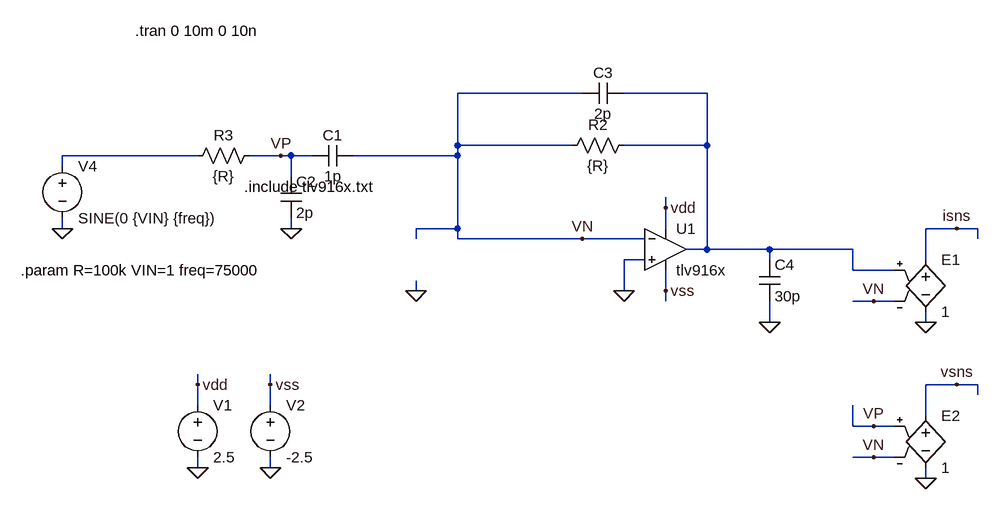
[diagram p0: schematic TIA_transe.asc]
TIA_transe.asc, the LTspice schematic file:
Version 4.1
SHEET 1 988 680
WIRE 368 -48 176 -48
WIRE 560 -48 432 -48
WIRE 176 32 176 -48
WIRE 352 32 176 32
WIRE 560 32 560 -48
WIRE 560 32 432 32
WIRE -224 48 -432 48
WIRE -96 48 -144 48
WIRE -80 48 -96 48
WIRE -48 48 -80 48
WIRE 176 48 176 32
WIRE 176 48 16 48
WIRE -432 64 -432 48
WIRE -80 80 -80 48
WIRE 496 128 496 112
WIRE -432 160 -432 144
WIRE -80 160 -80 144
WIRE 176 160 176 48
WIRE 176 160 112 160
WIRE 496 160 496 128
WIRE 944 160 896 160
WIRE 976 160 944 160
WIRE 112 176 112 160
WIRE 176 176 176 160
WIRE 368 176 176 176
WIRE 464 176 368 176
WIRE 976 176 976 160
WIRE 560 192 560 32
WIRE 560 192 528 192
WIRE 656 192 560 192
WIRE 784 192 656 192
WIRE 464 208 432 208
WIRE 656 208 656 192
WIRE 896 208 896 160
WIRE 784 224 784 192
WIRE 848 224 784 224
WIRE 112 256 112 240
WIRE 432 256 432 208
WIRE 496 256 496 224
WIRE 496 272 496 256
WIRE 816 272 784 272
WIRE 848 272 816 272
WIRE 656 304 656 272
WIRE 896 304 896 288
WIRE -224 400 -224 384
WIRE -112 400 -112 384
WIRE 944 400 896 400
WIRE 976 400 944 400
WIRE 976 416 976 400
WIRE -224 432 -224 400
WIRE -112 432 -112 400
WIRE 896 448 896 400
WIRE 784 464 784 432
WIRE 816 464 784 464
WIRE 848 464 816 464
WIRE 816 512 784 512
WIRE 848 512 816 512
WIRE -224 528 -224 512
WIRE -112 528 -112 512
WIRE 896 544 896 528
FLAG 496 256 vss
FLAG 496 128 vdd
FLAG -224 528 0
FLAG -224 400 vdd
FLAG -112 528 0
FLAG -112 400 vss
FLAG 432 256 0
FLAG 656 304 0
FLAG 112 256 0
FLAG -432 160 0
FLAG 368 176 VN
FLAG 816 272 VN
FLAG 896 304 0
FLAG 944 160 isns
FLAG -96 48 VP
FLAG 816 512 VN
FLAG 896 544 0
FLAG 944 400 vsns
FLAG 816 464 VP
FLAG -80 160 0
SYMBOL voltage -224 416 R0
WINDOW 123 0 0 Left 0
WINDOW 39 0 0 Left 0
SYMATTR InstName V1
SYMATTR Value 2.5
SYMBOL voltage -112 416 R0
WINDOW 123 0 0 Left 0
WINDOW 39 0 0 Left 0
SYMATTR InstName V2
SYMATTR Value -2.5
SYMBOL res 448 16 R90
WINDOW 0 0 56 VBottom 2
WINDOW 3 32 56 VTop 2
SYMATTR InstName R2
SYMATTR Value {R}
SYMBOL cap 432 -64 R90
WINDOW 0 0 32 VBottom 2
WINDOW 3 32 32 VTop 2
SYMATTR InstName C3
SYMATTR Value 2p
SYMBOL cap 640 208 R0
SYMATTR InstName C4
SYMATTR Value 30p
SYMBOL res -128 32 R90
WINDOW 0 0 56 VBottom 2
WINDOW 3 32 56 VTop 2
SYMATTR InstName R3
SYMATTR Value {R}
SYMBOL voltage -432 48 R0
WINDOW 123 0 0 Left 0
WINDOW 39 0 0 Left 0
SYMATTR InstName V4
SYMATTR Value SINE(0 {VIN} {freq})
SYMBOL e 896 192 R0
SYMATTR InstName E1
SYMATTR Value 1
SYMBOL e 896 432 R0
SYMATTR InstName E2
SYMATTR Value 1
SYMBOL OpAmps\\opamp2 496 128 R0
SYMATTR InstName U1
SYMATTR Value tlv916x
SYMBOL cap 16 32 R90
WINDOW 0 0 32 VBottom 2
WINDOW 3 32 32 VTop 2
SYMATTR InstName C1
SYMATTR Value 1p
SYMBOL cap -96 80 R0
SYMATTR InstName C2
SYMATTR Value 2p
TEXT -152 96 Left 2 !.include tlv916x.txt
TEXT -496 224 Left 2 !.param R=100k VIN=1 freq=75000
TEXT -320 -144 Left 2 !.tran 0 10m 0 10n

The netlist it stands for:
* TIA_transe.asc
V1 vdd 0 2.5
V2 vss 0 -2.5
R2 N001 VN {R}
C3 N001 VN 2p
C4 N001 0 30p
R3 VP N002 {R}
V4 N002 0 SINE(0 {VIN} {freq})
E1 isns 0 N001 VN 1
E2 vsns 0 VP VN 1
X§U1 0 VN vdd vss N001 tlv916x  ; pins In+ In- V+ V- OUT
C1 VN VP 1p
C2 VP 0 2p
.include tlv916x.txt
.param R=100k VIN=1 freq=75000
.tran 0 10m 0 10n
.backanno
.end

* Results of the author's LTspice run, read from the files saved beside the schematic
* Operating Point, zero values left out:
*   V(vdd) = 2.5 V
*   V(vss) = -2.5 V
*   I(V1) = -2.4 mA
*   I(V2) = 2.4 mA
*   Ix(u1:in+) = 10 pA
*   Ix(u1:vcc) = 2.4 mA
*   Ix(u1:vee) = -2.4 mA